# EAGLE schematic brain (EAGLE 6.1)

## Sheet 1 of 3
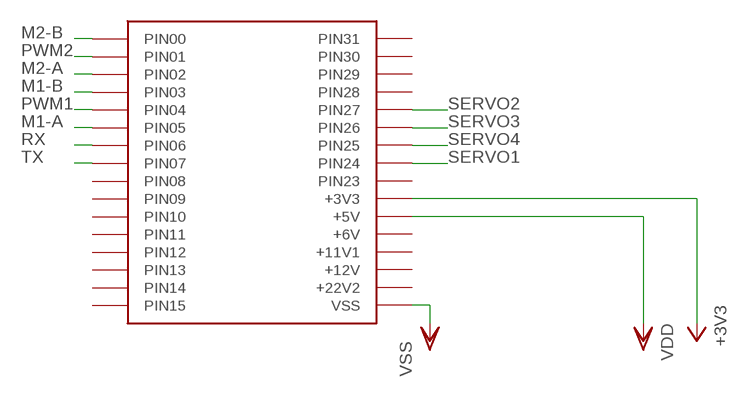
[diagram p0: schematic, sheet 1]

### Parts
U$1  BASE  [BASE]

### Nets
+3V3: U$1.PIN22(+3V3) ; also sheet 3
M1-A: U$1.PIN05 ; also sheet 2
M1-B: U$1.PIN03 ; also sheet 2
M2-A: U$1.PIN02 ; also sheet 2
M2-B: U$1.PIN00 ; also sheet 2
PWM1: U$1.PIN04 ; also sheet 2
PWM2: U$1.PIN01 ; also sheet 2
RX: U$1.PIN06 ; also sheet 2
SERVO1: U$1.PIN24 ; also sheet 2
SERVO2: U$1.PIN27 ; also sheet 2
SERVO3: U$1.PIN26 ; also sheet 2
SERVO4: U$1.PIN25 ; also sheet 2
TX: U$1.PIN07 ; also sheet 2
VDD: U$1.PIN21(+5V) ; also sheet 2,3
VSS: U$1.PIN16(VSS) ; also sheet 2,3
Unconnected: U$1.PIN08 U$1.PIN09 U$1.PIN10 U$1.PIN11 U$1.PIN12 U$1.PIN13 U$1.PIN14 U$1.PIN15 U$1.PIN17(+22V2) U$1.PIN18(+12V) U$1.PIN19(+11V1) U$1.PIN20(+6V) U$1.PIN23 U$1.PIN28 U$1.PIN29 U$1.PIN30 U$1.PIN31

## Sheet 2 of 3
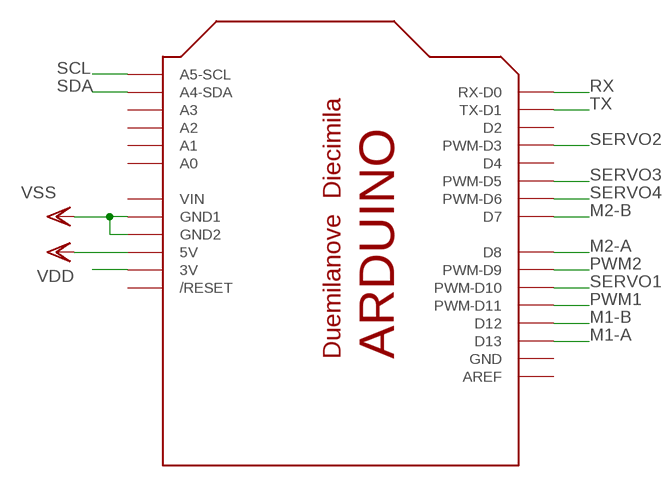
[diagram p1: schematic, sheet 2]

### Parts
U$6  ARDUINOUNO  [ARDUINO]

### Nets
M1-A: U$6.D13 ; also sheet 1
M1-B: U$6.D12 ; also sheet 1
M2-A: U$6.D8 ; also sheet 1
M2-B: U$6.D7 ; also sheet 1
N$5: U$6.3V
PWM1: U$6.D11(PWM-D11) ; also sheet 1
PWM2: U$6.D9(PWM-D9) ; also sheet 1
RX: U$6.D0(RX-D0) ; also sheet 1
SCL: U$6.A5(A5-SCL) ; also sheet 3
SDA: U$6.A4(A4-SDA) ; also sheet 3
SERVO1: U$6.D10(PWM-D10) ; also sheet 1
SERVO2: U$6.D3(PWM-D3) ; also sheet 1
SERVO3: U$6.D5(PWM-D5) ; also sheet 1
SERVO4: U$6.D6(PWM-D6) ; also sheet 1
TX: U$6.D1(TX-D1) ; also sheet 1
VDD: U$6.5V ; also sheet 1,3
VSS: U$6.GND1 U$6.GND2 ; also sheet 1,3
Unconnected: U$6.A0 U$6.A1 U$6.A2 U$6.A3 U$6.AREF U$6.D2 U$6.D4 U$6.RESET(/RESET)

## Sheet 3 of 3
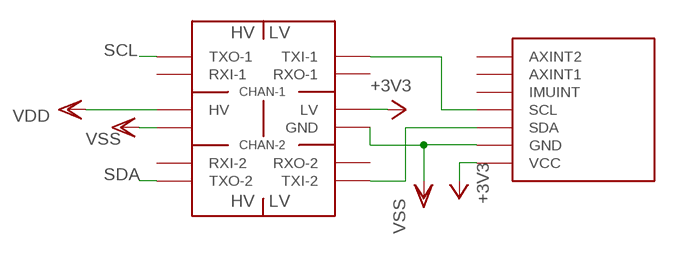
[diagram p2: schematic, sheet 3]

### Parts
U$7  IMU3000COMBO  [IMU3000-COMBO]
U$8  LOGIC-LEVEL-CONVERTER  [LEVEL-CONVERTER]

### Nets
+3V3: U$7.3V3(VCC) U$8.P$3(LV) ; also sheet 1
N$1: U$7.SCL U$8.P$1(TXI-1)
N$2: U$7.SDA U$8.P$6(TXI-2)
SCL: U$8.P$12(TXO-1) ; also sheet 2
SDA: U$8.P$7(TXO-2) ; also sheet 2
VDD: U$8.P$10(HV) ; also sheet 1,2
VSS: U$7.VSS(GND) U$8.P$4(GND) U$8.P$9 ; also sheet 1,2
Unconnected: U$7.AXINT1 U$7.AXINT2 U$7.IMUINT U$8.P$2(RXO-1) U$8.P$5(RXO-2) U$8.P$8(RXI-2) U$8.P$11(RXI-1)

## Power pins joined to a net without a drawn wire
GND: U$6.GND
VIN: U$6.VIN

## Library data of the parts
U$1 = aasanchez:BASE
U$6 = adafruit:ARDUINO: Arduino Diecimila/Duemilanove Make a shield with ease, this package has all the named pins as well as the two mounting drill holes and an outline of the USB and DC power connector. The outline is on the DIMENSION layer, so if your board house uses it they will cut the outline to match. http://www.ladyada.net/library/pcb/eaglelibrary.html
U$7 = aasanchez:IMU3000COMBO
U$8 = aasanchez:LOGIC-LEVEL-CONVERTER